# Altium schematic sheet power_module.SchDoc
size A4; SheetNumber: 1; SheetTotal: 3
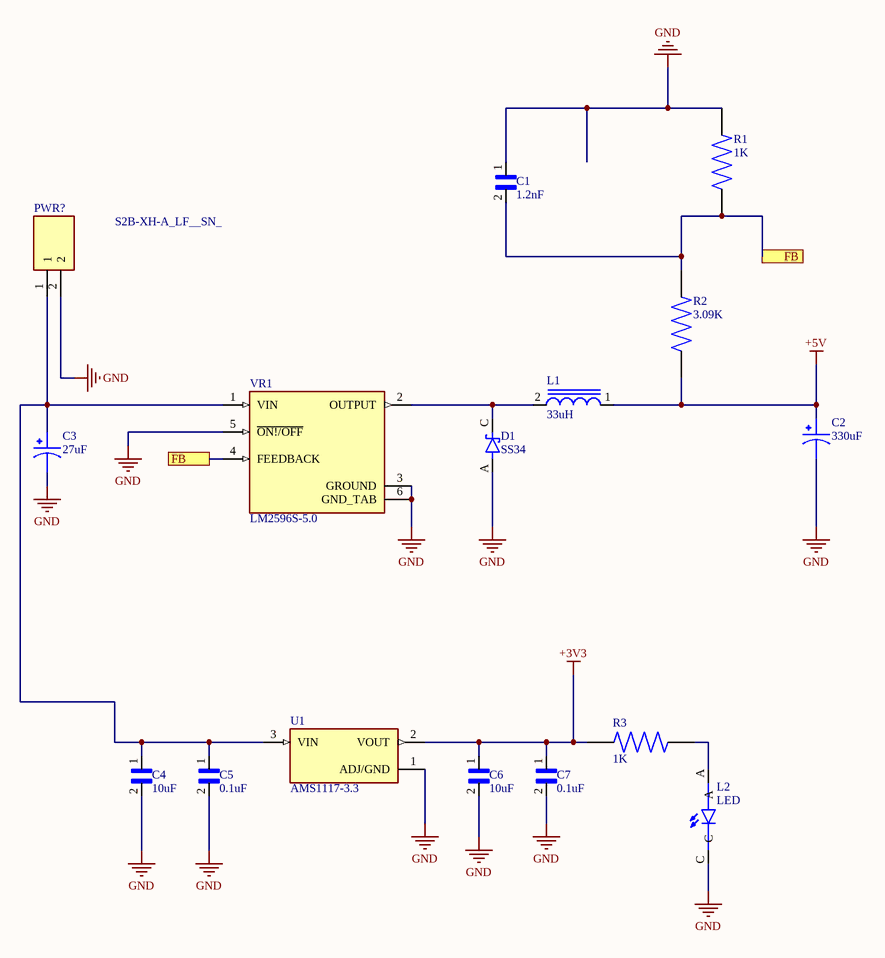
[diagram p0: power_module.SchDoc]

## Parts
C1  1.2nF  [CAP0805]
C2  330uF  [CAP220uF]
C3  27uF  [CAP220uF]
C4  10uF  [CAP0805]
C5  0.1uF  [CAP0805]
C6  10uF  [CAP0805]
C7  0.1uF  [CAP0805]
D1  SS34  [SS34DIODE]
L1  33uH  [INDUCTOR]
L2  LED  [LED]
PWR?  S2B-XH-A_LF__SN_  [SHDRRA2W80P0X250_1X2_740X1150X610P]
R1  1K  [RES0805]
R2  3.09K  [RES0805]
R3  1K  [RES0805]
U1  AMS1117-3.3  [SOT229P700X180-4N]
VR1  LM2596S-5.0  [LM2596S]

## Ports
FB

## Nets
+3V3: C6.1 C7.1 R3.2 U1.2(VOUT)
+5V: C2.1 L1.1 R2.1
GND: C1.1 C2.2 C3.2 C4.2 C5.2 C6.2 C7.2 D1.A L2.C PWR?.2 R1.2 U1.1(ADJ/GND) VR1.3(GROUND) VR1.5(~{ON!/OFF}) VR1.6(GND_TAB)
FB: C1.2 R1.1 R2.2 VR1.4(FEEDBACK) ; port FB
NetC3_1: C3.1 C4.1 C5.1 PWR?.1 U1.3(VIN) VR1.1(VIN)
NetD1_C: D1.C(K) L1.2 VR1.2(OUTPUT)
NetL2_A: L2.A R3.1

## Library data of the parts
C1 C4-C7 = CAP0805: 10000pF Â±5% 16V Ceramic Capacitor X7R 0805 _2012 Metric_; MF: AVX; MP: 0805YC103J4T2A; Package: 2012 AVX; Availability: Unavailable; Value: *; SnapEDA_Link: https://www.snapeda.com/parts/0805YC103J4T2A/AVX/view-part/606803/?ref=snap; Price: None
C2 C3 = CAP: 220µF 35V AND 100µf 50V Aluminum Electrolytic Capacitors Radial, Can 98.8mOhm @ 120Hz 2000 Hrs @ 85Â°C; MP: 478CKS010M; MF: Illinois Capacitor; SnapEDA_Link: https://www.snapeda.com/parts/478CKS010M/Illinois%20Capacitor/view-part/2347563/?ref=snap; Price: None; Mouser-Purchase-URL: https://snapeda.com/shop?store=Mouser&id=2347563; Availability: Warning; Package: Radial Illinois Capacitor; Value: *
D1 = SS34: Diode Schottky 40V 3A Surface Mount SMC _DO-214AB_; MF: ON Semiconductor; SnapEDA_Link: https://www.snapeda.com/parts/SS34/ON%20Semiconductor/view-part/4631325/?ref=snap; MP: SS34; Availability: Unavailable; Price: None; Value: *; Package: DO-214AB-214 ON Semiconductor
L1 = INDUCTOR: 33ÂµH Shielded Wirewound Inductor 3A 60mOhm Max Nonstandard; MF: Bourns; MP: SRR1260-330M; Price: None; Package: Nonstandard Bourns; Value: *; SnapEDA_Link: https://www.snapeda.com/parts/SRR1260-330M/Bourns/view-part/378985/?ref=snap; Availability: Unavailable
L2 = LED: Red LED Indication - Discrete 2V 0805 _2012 Metric_; MF: Lumex Opto/Components; MP: SML-LXT0805IW-TR; Value: *; Package: 0805 Lumex; Price: None; Availability: Unavailable; SnapEDA_Link: https://www.snapeda.com/parts/SML-LXT0805IW-TR/Lumex%20Opto/Components%20Inc./view-part/340416/?ref=snap
PWR? = S2B-XH-A_LF__SN_: XH-2.5mm Header side entry 2 way JST XH Series, Series Number S2B, 2.5mm Pitch 2 Way 1 Row Right Angle PCB Header, Solder Termination, 3A; Manufacturer_Name: JST (JAPAN SOLDERLESS TERMINALS); Manufacturer_Part_Number: S2B-XH-A(LF)(SN); Geometry.Height: 6.1mm; Mouser Part Number: *; Mouser Price/Stock: *; Arrow Part Number: S2B-XH-A(LF)(SN); Arrow Price/Stock: https://www.arrow.com/en/products/s2b-xh-a-lf-sn/jst-manufacturing?region=europe; Datasheet Link: http://www.jst-mfg.com/product/pdf/eng/eXH.pdf
R1-R3 = RES0805: 910 Ohms Â±1% 0.125W, 1/8W Chip Resistor 0805 _2012 Metric_ Moisture Resistant Thick Film; MF: Yageo; MP: RC0805FR-07910RL; Package: 2012 Rohm Semiconductor; Availability: Unavailable; Value: *; SnapEDA_Link: https://www.snapeda.com/parts/RC0805FR-07910RL/Yageo/view-part/106117/?ref=snap; Price: None
U1 = AMS1117-3.3: Sot223/Pkg 1-Amp 3.3-Volt Low Drop Out Voltage Regulatator; MF: Advanced Monolithic Systems; Price: None; Package: None; Value: *; MP: AMS1117-3.3; Availability: Unavailable; SnapEDA_Link: https://www.snapeda.com/parts/AMS1117-3.3/Advanced%20Monolithic%20Systems/view-part/53450/?ref=snap
VR1 = LM2596S-5.0: SIMPLE SWITCHER&reg; 4.5V to 40V, 3A Low Component Count Step-Down Regulator 5-DDPAK/TO-263; MF: Texas Instruments; MP: LM2596S-5.0/NOPB; DigiKey-Purchase-URL: https://snapeda.com/shop?store=DigiKey&id=15588; Mouser-Purchase-URL: https://snapeda.com/shop?store=Mouser&id=15588; SnapEDA_Link: https://www.snapeda.com/parts/LM2596S-5.0/NOPB/Texas%20Instruments/view-part/15588/?ref=snap; Price: None; Value: *; Availability: Good; Texas_Instruments-Purchase-URL: https://snapeda.com/shop?store=Texas+Instruments&id=15588; Package: TO-263-5 Texas Instruments